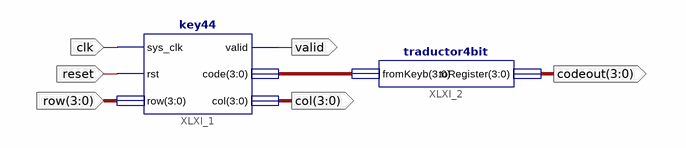
[diagram p0: schematic sheet 1]
// Xilinx ISE schematic keyboard.sch (spartan3e) as structural Verilog: 2 symbols, 6 ports
module keyboard (
  input  clk,
  input  reset,
  input  [3:0] row,
  output valid,
  output [3:0] col,
  output [3:0] codeout
);

  wire [3:0] XLXN_1;

  key44 XLXI_1 (.sys_clk(clk), .rst(reset), .row(row), .valid(valid), .code(XLXN_1), .col(col));
  traductor4bit XLXI_2 (.fromKeyb(XLXN_1), .toRegister(codeout));
endmodule
